# EAGLE design FrontPanel (EAGLE 9.2.2)
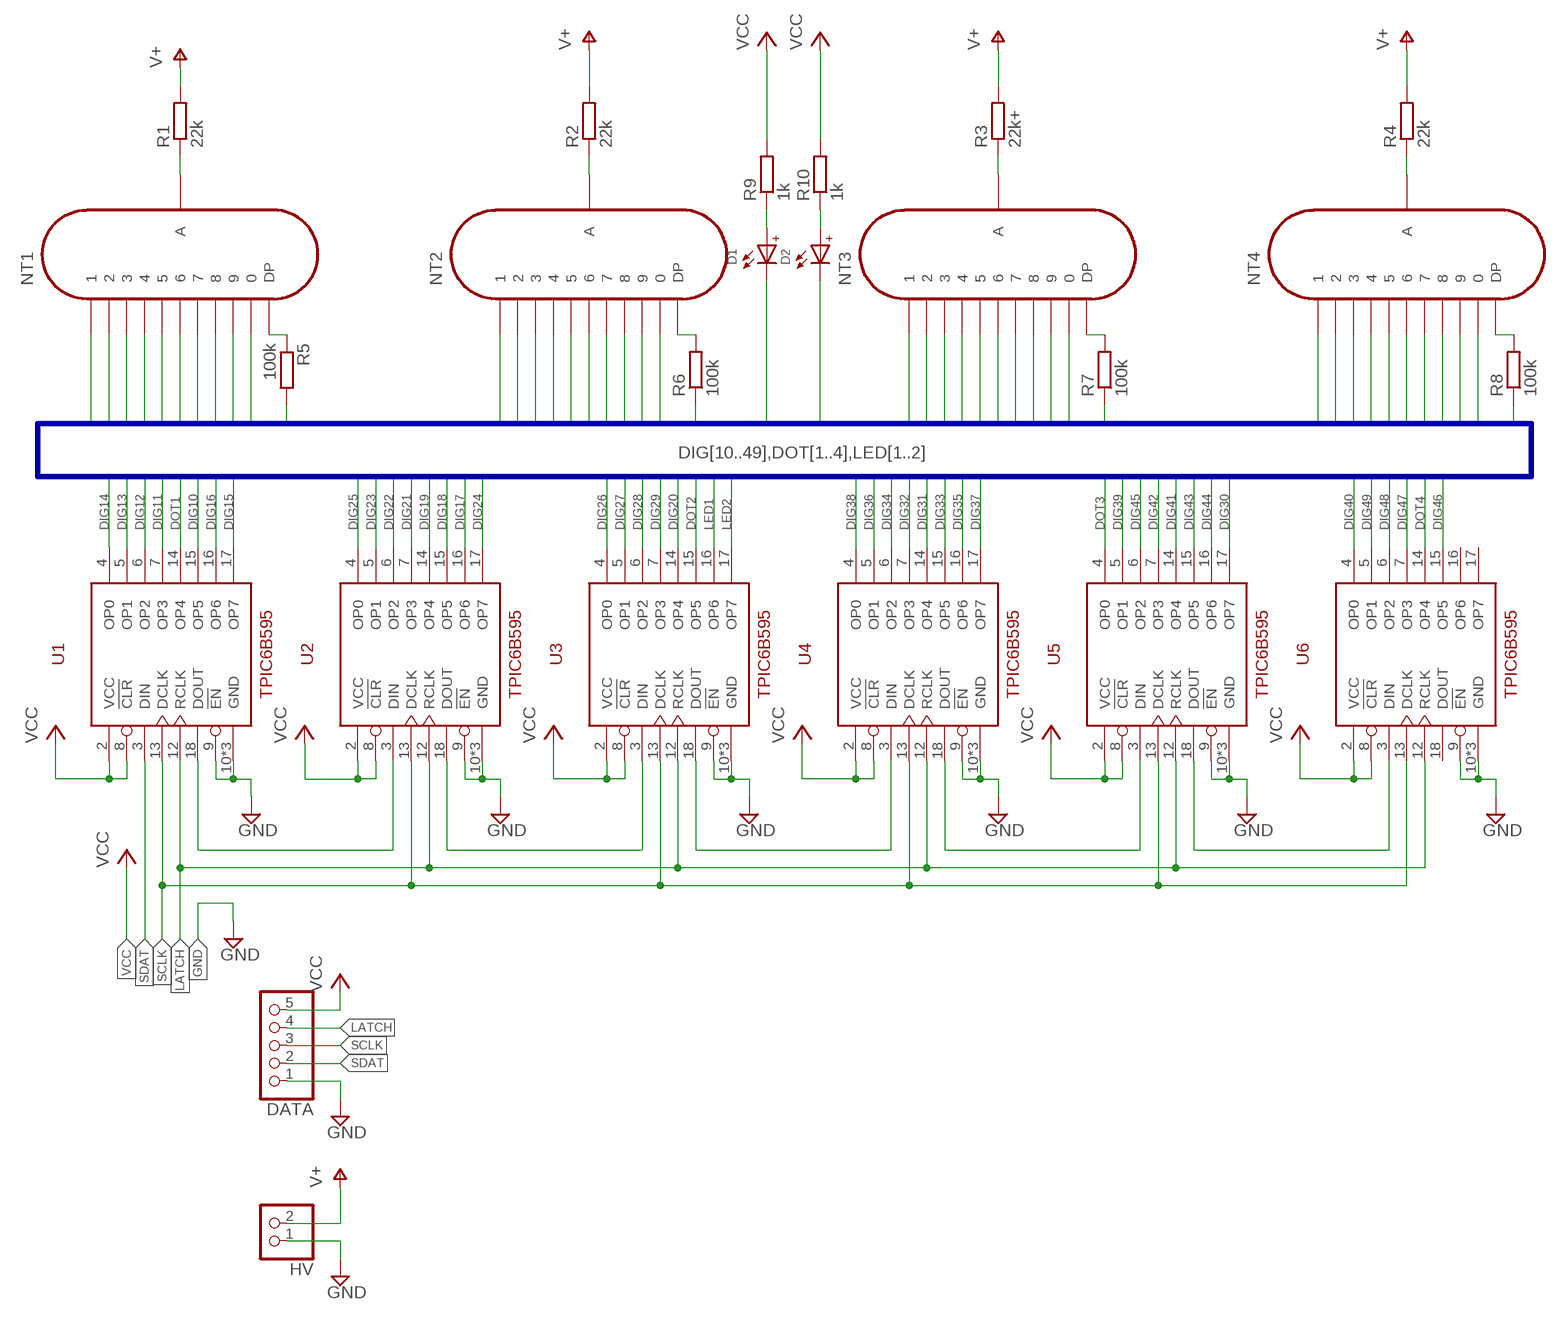
[diagram p0: schematic, sheet 1]

## Parts
D1  RED/AMBER  WL-SITW_3528_15414185BA210  [WL-SITW_154141XXBA210]
D2  RED/AMBER  WL-SITW_3528_15414185BA210  [WL-SITW_154141XXBA210]
DATA  .1" Header  PINHD-1X5  [1X05]
HV  .1" Header  PINHD-1X2  [1X02]
NT1  IN-12B  [IN-12]
NT2  IN-12B  [IN-12]
NT3  IN-12B  [IN-12]
NT4  IN-12B  [IN-12]
R1  22k  R-EU_0207/10  [0207/10]
R2  22k  R-EU_0207/10  [0207/10]
R3  22k+  R-EU_0207/10  [0207/10]
R4  22k  R-EU_0207/10  [0207/10]
R5  100k  R-EU_0207/10  [0207/10]
R6  100k  R-EU_0207/10  [0207/10]
R7  100k  R-EU_0207/10  [0207/10]
R8  100k  R-EU_0207/10  [0207/10]
R9  1k  R-EU_0207/10  [0207/10]
R10  1k  R-EU_0207/10  [0207/10]
U1  TPIC6B595N  [PDIP-20]
U2  TPIC6B595N  [PDIP-20]
U3  TPIC6B595N  [PDIP-20]
U4  TPIC6B595N  [PDIP-20]
U5  TPIC6B595N  [PDIP-20]
U6  TPIC6B595N  [PDIP-20]

## Nets
DIG10: NT1.0 U1.15(OP5)
DIG11: NT1.1 U1.7(OP3)
DIG12: NT1.2 U1.6(OP2)
DIG13: NT1.3 U1.5(OP1)
DIG14: NT1.4 U1.4(OP0)
DIG15: NT1.5 U1.17(OP7)
DIG16: NT1.6 U1.16(OP6)
DIG17: NT1.7 U2.16(OP6)
DIG18: NT1.8 U2.15(OP5)
DIG19: NT1.9 U2.14(OP4)
DIG20: NT2.0 U3.14(OP4)
DIG21: NT2.1 U2.7(OP3)
DIG22: NT2.2 U2.6(OP2)
DIG23: NT2.3 U2.5(OP1)
DIG24: NT2.4 U2.17(OP7)
DIG25: NT2.5 U2.4(OP0)
DIG26: NT2.6 U3.4(OP0)
DIG27: NT2.7 U3.5(OP1)
DIG28: NT2.8 U3.6(OP2)
DIG29: NT2.9 U3.7(OP3)
DIG30: NT3.0 U5.17(OP7)
DIG31: NT3.1 U4.14(OP4)
DIG32: NT3.2 U4.7(OP3)
DIG33: NT3.3 U4.15(OP5)
DIG34: NT3.4 U4.6(OP2)
DIG35: NT3.5 U4.16(OP6)
DIG36: NT3.6 U4.5(OP1)
DIG37: NT3.7 U4.17(OP7)
DIG38: NT3.8 U4.4(OP0)
DIG39: NT3.9 U5.5(OP1)
DIG40: NT4.0 U6.4(OP0)
DIG41: NT4.1 U5.14(OP4)
DIG42: NT4.2 U5.7(OP3)
DIG43: NT4.3 U5.15(OP5)
DIG44: NT4.4 U5.16(OP6)
DIG45: NT4.5 U5.6(OP2)
DIG46: NT4.6 U6.15(OP5)
DIG47: NT4.7 U6.7(OP3)
DIG48: NT4.8 U6.6(OP2)
DIG49: NT4.9 U6.5(OP1)
DOT1: R5.2 U1.14(OP4)
DOT2: R6.1 U3.15(OP5)
DOT3: R7.1 U5.4(OP0)
DOT4: R8.1 U6.14(OP4)
GND: DATA.1 HV.1 U1.9(!EN) U1.10(GND) U1.11(GND) U1.19(GND) U2.9(!EN) U2.10(GND) U2.11(GND) U2.19(GND) U3.9(!EN) U3.10(GND) U3.11(GND) U3.19(GND) U4.9(!EN) U4.10(GND) U4.11(GND) U4.19(GND) U5.9(!EN) U5.10(GND) U5.11(GND) U5.19(GND) U6.9(!EN) U6.10(GND) U6.11(GND) U6.19(GND)
LATCH: DATA.4 U1.12(RCLK) U2.12(RCLK) U3.12(RCLK) U4.12(RCLK) U5.12(RCLK) U6.12(RCLK)
LED1: D1.2(-) U3.16(OP6)
LED2: D2.2(-) U3.17(OP7)
N$45: NT1.LHDP(DP) R5.1
N$46: NT2.LHDP(DP) R6.2
N$47: NT3.LHDP(DP) R7.2
N$48: NT4.LHDP(DP) R8.2
N$49: NT1.A R1.1
N$50: NT2.A R2.1
N$51: NT3.A R3.1
N$52: NT4.A R4.1
N$55: U1.18(DOUT) U2.3(DIN)
N$56: U2.18(DOUT) U3.3(DIN)
N$57: U3.18(DOUT) U4.3(DIN)
N$58: U4.18(DOUT) U5.3(DIN)
N$59: U5.18(DOUT) U6.3(DIN)
N$66: D1.1(+) R9.1
N$67: D2.1(+) R10.1
SCLK: DATA.3 U1.13(DCLK) U2.13(DCLK) U3.13(DCLK) U4.13(DCLK) U5.13(DCLK) U6.13(DCLK)
SDAT: DATA.2 U1.3(DIN)
V+: HV.2 R1.2 R2.2 R3.2 R4.2
VCC: DATA.5 R9.2 R10.2 U1.2(VCC) U1.8(!CLR) U2.2(VCC) U2.8(!CLR) U3.2(VCC) U3.8(!CLR) U4.2(VCC) U4.8(!CLR) U5.2(VCC) U5.8(!CLR) U6.2(VCC) U6.8(!CLR)
Unconnected: U6.16(OP6) U6.17(OP7) U6.18(DOUT)

## Buses
DIG[10..49],DOT[1..4],LED[1..2]

## Library data of the parts
D1 D2 = Wurth_Elektronik_Optoelectronics_rev18a:WL-SITW_3528: WL-SITW SMD Infrared TOP LED Waterclear Characteristics Standard size 3528 Low energy consumption High reliability Low current requirement Fast switching IR Emitter Applications Infrared sensor Distance measure Remote control IR Lightbarrier Smoke detector <http://katalog.we-online.de/media/images/v2/Family_SITW-3528_15414185BA220.jpg> Details see: http://katalog.we-online.de/en/led/WL-SITW?m Created By Yingchun Shan 2018-03-09 2018 (C) Wurth Elektronik
DATA = pinhead:PINHD-1X5: PIN HEADER
HV = pinhead:PINHD-1X2: PIN HEADER
NT1-NT4 = NixieClock:IN-12B
R1-R10 = rcl:R-EU_: RESISTOR, European symbol; SPICEPREFIX: R
U1-U6 = NixieClock:TPIC6B595

## Board
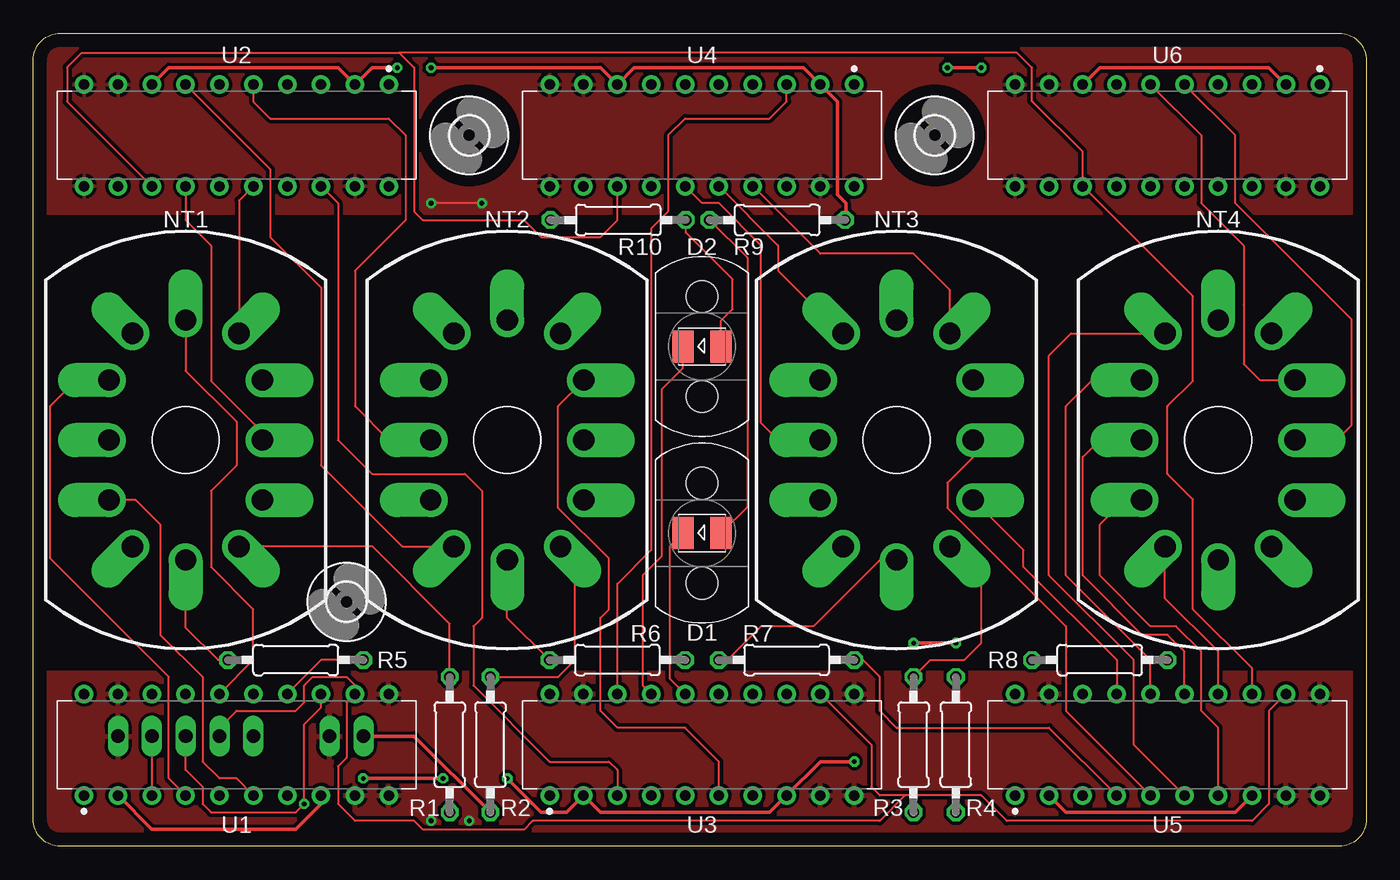
[diagram p1: board, top side]
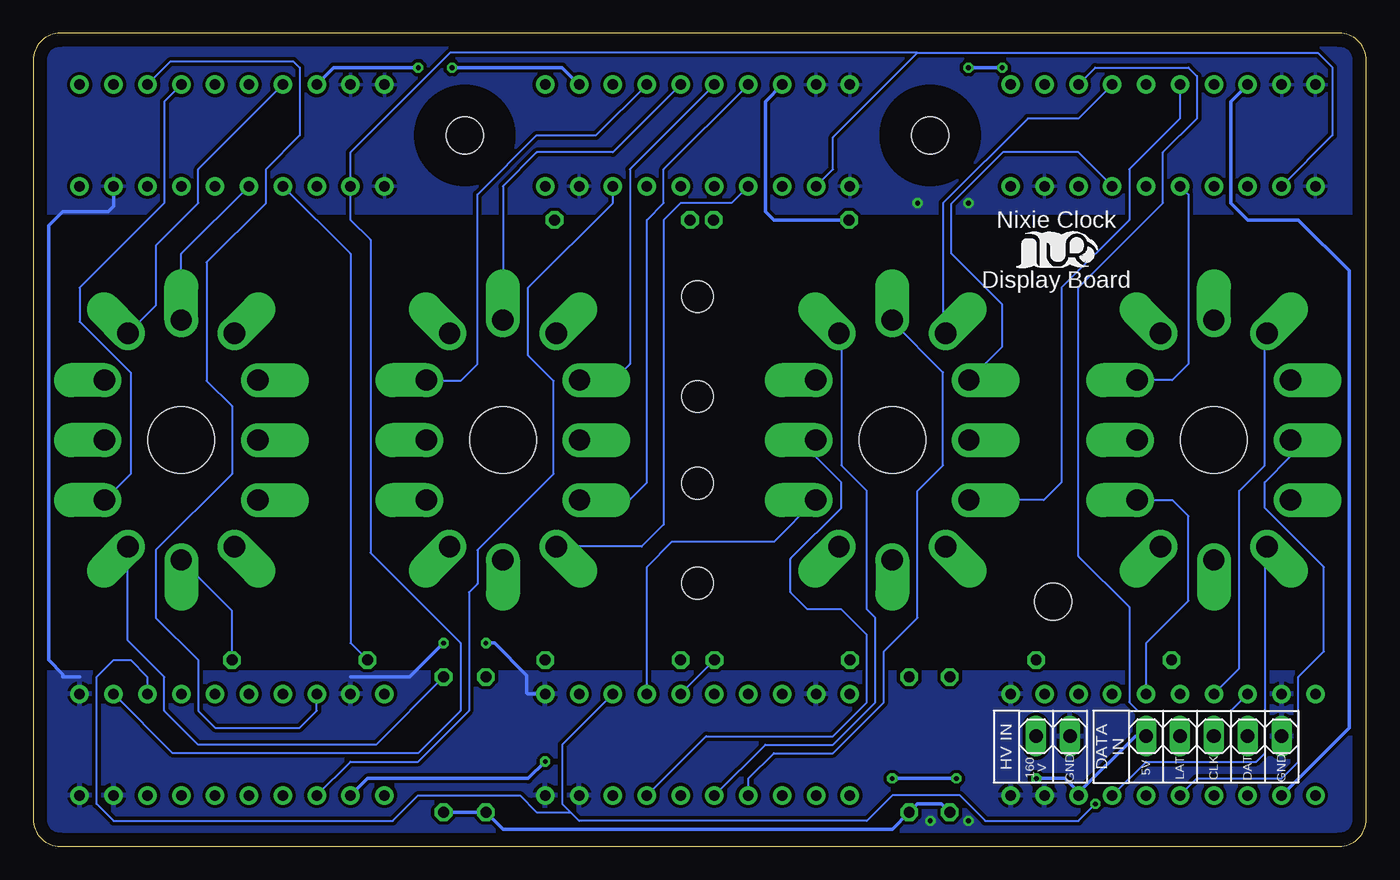
[diagram p2: board, bottom side, seen from below]

Size 100 x 61 mm. Coordinates in mm from the lower left corner, seen from the top.
Outline: 2,0 arc-90 0,2 0,59 arc-90 2,61 98,61 arc-90 100,59 100,2 arc-90 98,0 2,0
Copper layers (1*16): Top 0.035mm / dielectric 1.5mm / Bottom 0.035mm
Design rules "2layer": minimum track width 6mil, minimum drill 0.35mm, track to track 8mil, track to pad 8mil, pad to pad 8mil, via to via 8mil, smd to smd 6mil, copper to edge 40mil, drill to drill 6mil, minimum pad ring 10mil, minimum via ring 8mil, stop-mask expansion 4mil, vias tented up to drill 40mil, thermal gap 10mil

### Footprints (pad centres in the part's own frame; a part is rotated, then mirrored left to right if it is on the bottom)
WL-SITW_154141XXBA210 = smd 1.6 x 2.4: 1 -1.425,0; 2 1.425,0
1X05 = drill 1.016 long: 1 -5.08,0; 2 -2.54,0; 3 0,0; 4 2.54,0; 5 5.08,0
1X02 = drill 1.016 long: 1 -1.27,0; 2 1.27,0
IN-12 = drill 1.6 pad 2.54 offset: 0 5.75,-4.5; 1 -4,-8; 2 -5.75,-4.5; 3 -5.75,0; 4 -5.75,4.5; 5 -4,8; 6 0,9; 7 4,8; 8 5.75,4.5; 9 5.75,0; A 4,-8; LHDP 0,-9 | hole 5: 0,0
0207/10 = drill 0.813 octagon: 1 -5.08,0; 2 5.08,0
PDIP-20 = drill 0.786 pad 1.386: 1 -3.81,11.43; 2 -3.81,8.89; 3 -3.81,6.35; 4 -3.81,3.81; 5 -3.81,1.27; 6 -3.81,-1.27; 7 -3.81,-3.81; 8 -3.81,-6.35; 9 -3.81,-8.89; 10 -3.81,-11.43; 11 3.81,-11.43; 12 3.81,-8.89; 13 3.81,-6.35; 14 3.81,-3.81; 15 3.81,-1.27; 16 3.81,1.27; 17 3.81,3.81; 18 3.81,6.35; 19 3.81,8.89; 20 3.81,11.43
2,8 = hole 2.8: 0,0
MENTOR-1216.1005 = hole 2.4: -3.75,0; 3.75,0

### Placement (x,y rotation side)
D1  50.16,23.5 180 top
D2  50.16,37.5 180 top
DATA  11.43,8.26 180 bottom
HV  23.5,8.26 180 bottom
NT1  11.43,30.48 0 top
NT2  35.56,30.48 0 top
NT3  64.77,30.48 0 top
NT4  88.9,30.48 0 top
R1  31.24,7.62 270 top
R2  34.29,7.62 270 top
R3  66.04,7.62 270 top
R4  69.22,7.62 270 top
R5  19.68,13.97 0 top
R6  43.81,13.97 180 top
R7  56.52,13.97 180 top
R8  80.01,13.97 0 top
R9  55.81,46.99 0 top
R10  43.88,46.99 180 top
U1  15.24,7.62 90 top
U2  15.24,53.34 270 top
U3  50.16,7.62 90 top
U4  50.16,53.34 270 top
U5  85.09,7.62 90 top
U6  85.09,53.34 270 top
U$1  [2,8]  67.63,53.34 0 top
U$2  [2,8]  32.7,53.34 0 top
U$3  [2,8]  23.5,18.34 0 top
U$4  [LOGO-SILKSCREEEN-S]  23.25,44.25 0 bottom
U$5  [MENTOR-1216.1005]  50.16,37.5 90 top
U$6  [MENTOR-1216.1005]  50.16,23.5 90 top

### Tracks (layer width: path | path; a pad name or v marks a point on that pad's centre or on a via)
DIG10
  Bottom 0.152: U1.15 16.51,15.24 13.34,18.41 13.34,24.77 14.55,25.98 NT1.0
DIG11
  Bottom 0.152: U1.7 16.51,6.35 8.26,6.35 7.62,6.99 7.62,22.29 NT1.1
DIG12
  Top 0.152: NT1.2 7.67,25.98 9.53,24.13 9.53,15.88 12.7,12.7 12.7,6.35 13.97,5.08 15.24,5.08 U1.6
DIG13
  Bottom 0.152: U1.5 12.7,5.08 6.35,5.08 5.08,6.35 5.08,12.7 3.17,14.61 3.17,20.95 7.62,25.4 7.62,27.3 5.68,29.25 NT1.3
DIG14
  Top 0.152: NT1.4 3.23,34.98 1.27,33.02 1.27,21.59 10.16,12.7 10.16,5.08 U1.4
DIG15
  Bottom 0.152: U1.17 9.53,13.34 9.53,26.67 7.62,28.57 7.62,38.29 NT1.5
DIG16
  Top 0.152: NT1.6 11.43,35.67 15.24,31.86 15.24,28.57 13.34,26.67 13.34,20.95 16.51,17.78 16.51,13.97 U1.16
DIG17
  Top 0.152: U2.16 15.43,48.45 NT1.7
DIG18
  Bottom 0.152: U2.15 13.34,48.9 13.34,36.2 14.55,34.98 NT1.8
DIG19
  Top 0.152: U2.14 11.43,46.99 13.34,45.09 13.34,34.92 17.18,31.08 NT1.9
DIG20
  Bottom 0.152: NT2.0 44.44,22.85 44.45,22.86 52.07,22.86 53.98,20.95 U3.14
DIG21
  Top 0.152: U2.7 17.78,50.8 17.78,45.72 21.59,41.91 21.59,28.57 27.68,22.48 NT2.1
DIG22
  Bottom 0.152: U2.6 13.97,54.61 17.78,50.8 17.78,46.99 22.86,41.91 22.86,27.3 24.18,25.98 NT2.2
DIG23
  Top 0.152: U2.5 16.51,55.88 17.78,54.61 26.67,54.61 27.94,53.34 27.94,46.99 24.13,43.18 24.13,33.02 26.67,30.48 NT2.3
DIG24
  Bottom 0.152: U2.17 21.59,52.07 27.27,52.07 31.11,48.23 31.11,44.45 27.3,40.64 27.3,37.48 NT2.4
DIG25
  Bottom 0.152: U2.4 21.59,54.61 25.4,54.61 31.75,48.26 31.75,38.67 NT2.5
DIG26
  Bottom 0.152: U3.4 46.35,5.08 44.45,6.99 40.01,6.99 36.2,10.79 36.2,14.61 33.66,17.14 33.66,26.67 31.75,28.57 31.75,35.56 35.56,39.37 NT2.6
DIG27
  Bottom 0.152: U3.5 45.09,7.62 40.01,7.62 36.83,10.79 36.83,17.14 37.47,17.78 37.47,26.67 39.37,28.57 39.37,38.29 NT2.7
DIG28
  Top 0.152: U3.6 51.44,6.35 48.9,8.89 43.81,8.89 42.55,10.16 42.55,17.14 43.18,17.78 43.18,21.59 39.37,25.4 39.37,33.02 41.31,34.96 NT2.8
DIG29
  Bottom 0.152: U3.7 49.53,8.26 40.01,8.26 37.47,10.79 37.47,15.88 39.37,17.78 41.91,17.78 43.18,19.05 43.18,21.59 39.37,25.4 39.37,27.3 41.31,29.25 NT2.9
DIG30
  Top 0.152: NT3.0 70.54,25.98 74.3,22.23 74.3,20.95 81.28,13.97 U5.17
DIG31
  Bottom 0.152: NT3.1 54.35,22.48 52.7,24.13 52.7,46.99 51.44,48.26 47.62,48.26 U4.14
DIG32
  Bottom 0.152: U4.7 52.7,50.8 52.7,48.26 53.98,46.99 53.98,27.3 55.24,26.04 58.97,26.04 NT3.2
DIG33
  Top 0.152: NT3.3 55.88,30.48 54.61,31.75 54.61,45.09 51.44,48.26 50.16,48.26 U4.15
DIG34
  Bottom 0.152: U4.6 55.24,50.8 55.24,36.2 56.46,34.98 NT3.4
DIG35
  Top 0.152: U4.16 55.88,45.09 55.88,43.18 60.58,38.48 NT3.5
DIG36
  Bottom 0.152: NT3.6 64.77,49.53 62.23,52.07 56.52,52.07 U4.5
DIG37
  Top 0.152: NT3.7 68.77,41.72 66.04,44.45 59.05,44.45 U4.17
DIG38
  Bottom 0.152: NT3.8 70.47,34.92 67.94,34.92 66.67,36.2 66.67,48.9 62.23,53.34 57.78,53.34 U4.4
DIG39
  Top 0.152: NT3.9 70.52,29.21 68.58,27.27 68.58,25.4 77.47,16.51 77.47,10.16 U5.5
DIG40
  Bottom 0.152: U6.4 90.17,55.88 90.17,48.26 96.52,41.91 96.52,39.36 92.71,35.55 92.71,27.92 NT4.0
DIG41
  Top 0.152: U5.14 88.9,14.61 84.9,18.61 NT4.1
DIG42
  Top 0.152: U5.7 88.9,8.89 87.63,10.16 87.63,14.61 85.72,16.51 83.82,16.51 80.01,20.32 80.01,24.13 81.86,25.98 NT4.2
DIG43
  Top 0.152: NT4.3 80.01,30.48 78.74,29.21 78.74,20.32 83.19,15.88 85.09,15.88 86.36,14.61 U5.15
DIG44
  Top 0.152: U5.16 83.82,13.97 77.47,20.32 77.47,33.02 79.38,34.92 83.09,34.92 NT4.4
DIG45
  Top 0.152: U5.6 82.55,7.62 82.55,13.97 76.2,20.32 76.2,36.83 77.85,38.48 NT4.5
DIG46
  Bottom 0.152: U6.15 88.9,44.45 NT4.6
DIG47
  Bottom 0.152: U6.7 87.63,50.8 87.63,48.26 90.81,45.09 90.81,40.58 NT4.7
DIG48
  Top 0.152: U6.6 87.63,53.34 87.63,48.26 90.81,45.09 90.81,40.64 90.81,36.2 92.02,34.98 NT4.8
DIG49
  Top 0.152: U6.5 90.17,53.34 90.17,48.26 98.91,39.52 98.91,31.6 97.79,30.48 NT4.9
DOT1
  Top 0.152: R5.2 21.59,13.97 U1.14
DOT2
  Bottom 0.152: U3.15 R6.1
DOT3
  Top 0.152: R7.1 62.23,13.97 63.5,12.7 63.5,10.16 64.77,8.89 76.2,8.89 U5.4
DOT4
  Bottom 0.152: U6.14 76.2,44.45 76.2,15.24 R8.1
GND  (via drill 0.35)
  Top 0.152: v33.66,48.26 v29.84,48.26
  Top 0.254: v69.22,15.24 v66.04,15.24
  Bottom 0.254: v66.04,15.24 65.41,15.24 63,12.84 63,11.5 62.93,11.43 U3.11 | v69.22,15.24 71.75,12.7 76.2,12.7 | 96.52,12.7 97.79,12.7 97.79,12.9 98.86,13.97 98.86,46.56 97.79,47.62 94.38,47.62 93.98,48.02 U6.19
  other vias: 29.84,1.91 32.7,1.91
  pour Top (isolate 0.254): 0,0 0,13 100,13 100,0
  pour Top (isolate 0.254): 0,61 0,47.5 100,47.5 100,61
  pour Bottom (isolate 0.254): 0,61 0,47.5 100,47.5 100,61
  pour Bottom (isolate 0.254): 0,0 0,13 100,13 100,0
LATCH
  Top 0.152: U3.12 62.87,7.62 62.87,4.45 63.5,3.81 65.41,3.81 | U5.12 92.71,10.16 92.71,3.17 91.44,1.91 73.03,1.91 71.12,3.81 65.41,3.81 | 65.41,3.81 63.5,1.91 37.47,1.91 36.81,1.25 29.23,1.25 28.57,1.91 24.13,1.91 22.86,3.17 22.86,6 23.5,6.63 23.5,10.79 U1.12 24.13,12.06 23.5,12.7 20.95,12.7 20.32,12.06 20.32,10.79 19.68,10.16 15.24,10.16 13.97,8.89 DATA.4
  Bottom 0.152: U2.12 2.54,53.34 2.54,58.45 3.62,59.54 33.66,59.54 | U4.12 40.01,50.8 40.01,53.19 33.66,59.54 | U5.12 89.53,6.99 71.12,6.99 67.94,10.16 67.94,15.24 74.71,22.01 74.71,45.5 76.2,46.99 U6.12 76.2,52.07 68.73,59.54 33.66,59.54
LED1
  Top 0.152: D1.2 47.74,22.5 47.74,12.59 U3.16
LED2
  Top 0.152: U3.17 45.72,12.06 45.72,20.32 47.16,21.77 47.16,34.29 48.74,35.87 D2.2
N$45
  Top 0.152: R5.1 13.86,13.97 11.43,16.4 NT1.LHDP
N$46
  Top 0.152: R6.2 35.56,17.14 NT2.LHDP
N$47
  Top 0.152: NT3.LHDP 63.5,21.48 58.53,16.51 54.61,16.51 52.07,13.97 R7.2
N$48
  Bottom 0.152: R8.2 85.09,17.67 NT4.LHDP
N$49
  Top 0.152: R1.1 31.24,16.7 25.46,22.48 NT1.A
N$50
  Top 0.152: R2.1 39.37,12.7 40.64,13.97 40.64,21.4 NT2.A
N$51
  Top 0.152: R3.1 67.31,13.97 69.85,13.97 71.12,15.24 71.12,20.13 NT3.A
N$52
  Bottom 0.152: R4.1 74.3,7.62 87.63,7.62 90.17,10.16 90.17,12.7 92.9,15.43 NT4.A
N$55
  Bottom 0.152: U2.3 20.32,58.42 13.34,58.42 12.7,57.78 12.7,54.61 15.24,52.07 15.24,48.26 21.59,41.91 21.59,21.76 17.78,17.95 17.78,10.79 17.14,10.16 10.16,10.16 U1.18
N$56
  Top 0.152: U2.18 22.86,48.26 22.86,30.48 25.4,27.94 32.38,27.94 33.66,26.67 33.66,17.14 33.02,16.51 33.02,12.06 38.73,6.35 43.18,6.35 43.81,5.71 U3.3
N$57
  Top 0.152: U3.18 43.81,19.68 46.35,22.23 46.35,46.35 47.62,47.62 47.62,53.34 48.9,54.61 55.24,54.61 56.52,55.88 U4.3
N$58
  Bottom 0.152: U5.3 76.2,6.35 71.12,6.35 67.31,10.16 67.31,19.05 66.67,19.68 66.67,22.23 60.96,27.94 60.96,34.92 62.87,36.83 62.87,41.91 56.52,48.26 U4.18
N$59
  Bottom 0.152: U6.3 89.69,58.9 80.49,58.9 80.01,58.42 80.01,53.34 82.55,50.8 82.55,48.26 87,43.81 87,34.92 85.09,33.02 85.09,27.94 90.81,22.23 90.81,17.14 87.63,13.97 87.63,10.16 86.36,8.89 80.01,8.89 78.74,10.16 U5.18
N$66
  Top 0.152: D1.1 53.56,25.47 53.56,44.16 R9.1
N$67
  Top 0.152: D2.1 51.59,39.43 52.46,40.3 52.46,42.54 48.96,46.04 R10.1
SCLK  (via drill 0.35)
  Top 0.152: U2.13 2.54,55.88 2.54,58.45 3.62,59.54 27.46,59.54 | U5.13 91.44,13.34 87,17.78 87,26.04 85.09,27.94 85.09,33.02 87,34.92 87,41.27 U6.13 78.74,52.1 74.96,55.88 74.93,55.88 74.93,58.42 73.81,59.54 27.46,59.54 | 27.46,59.54 28.57,58.42 28.57,47.62 29.21,46.99 36.83,46.99 38.1,45.72 42.55,45.72 43.81,46.99 U4.13 | U1.13 21.59,10.43 20.32,9.16 v20.32,3.17 19.68,2.54 13.34,2.54 12.7,3.17 12.7,4.45 11.43,5.71 DATA.3
  Bottom 0.152: 59.69,2.54 59.05,1.91 37.47,1.91 35.56,3.81 30.48,3.81 28.57,1.91 21.59,1.91 v20.32,3.17 | 59.69,2.54 60.33,3.17 60.33,7.62 U3.13 | 59.69,2.54 62.23,2.54 63.5,3.81 71.12,3.81 73.03,1.91 93.98,1.91 95.25,3.17 95.25,12.7 93.98,13.97 92.71,13.97 91.44,12.7 U5.13
SDAT
  Top 0.152: DATA.2 U1.3
V+
  Top 0.254: HV.2 28.57,8.26 R2.2
  Bottom 0.254: R1.2 31.88,3.17 33.66,3.17 R2.2 35.56,1.27 64.77,1.27 R3.2 R4.2
VCC  (via drill 0.35)
  Top 0.254: U6.8 80.01,58.42 92.71,58.42 U6.2 | v68.58,58.42 v71.12,58.42 | U2.8 10.16,58.42 22.86,58.42 U2.2 25.4,58.42 v27.3,58.42 | v29.84,58.42 42.55,58.42 U4.8 45.09,58.42 57.78,58.42 U4.2 60.33,55.88 60.33,48.9 60.96,48.26 60.96,47.05 R9.2 | v35.56,5.08 38.1,2.54 40.01,2.54 U3.2 42.55,2.54 55.24,2.54 U3.8 59.05,6.35 v61.59,6.35 | U1.2 8.89,1.27 19.68,1.27 21.59,3.17 U1.8 | U5.2 77.47,2.54 90.17,2.54 U5.8 | v24.75,5.08 v30.75,5.08
  Bottom 0.254: U4.8 45.09,55.88 45.09,47.62 44.45,46.99 R10.2 | U4.2 60.33,58.42 v68.58,58.42 | U6.8 77.47,58.42 v71.12,58.42 | v27.3,58.42 v29.84,58.42 | U1.2 1.27,8.89 1.27,43.18 5.08,46.99 8.89,46.99 10.16,48.26 10.16,55.88 U2.8 | v61.59,6.35 62.87,5.08 74.93,5.08 U5.2 | DATA.5 17.34,8.26 21.59,4 U1.8 21.59,4.08 22.59,5.08 v24.75,5.08 | v35.56,5.08 v30.75,5.08

### Text on the board
bPlace: Nixie Clock | Display Board | DATA / IN | HV IN | GND | DAT | CLK | LAT | 5V | GND | 160 / V